# EAGLE design circuit (EAGLE 9.6.2)
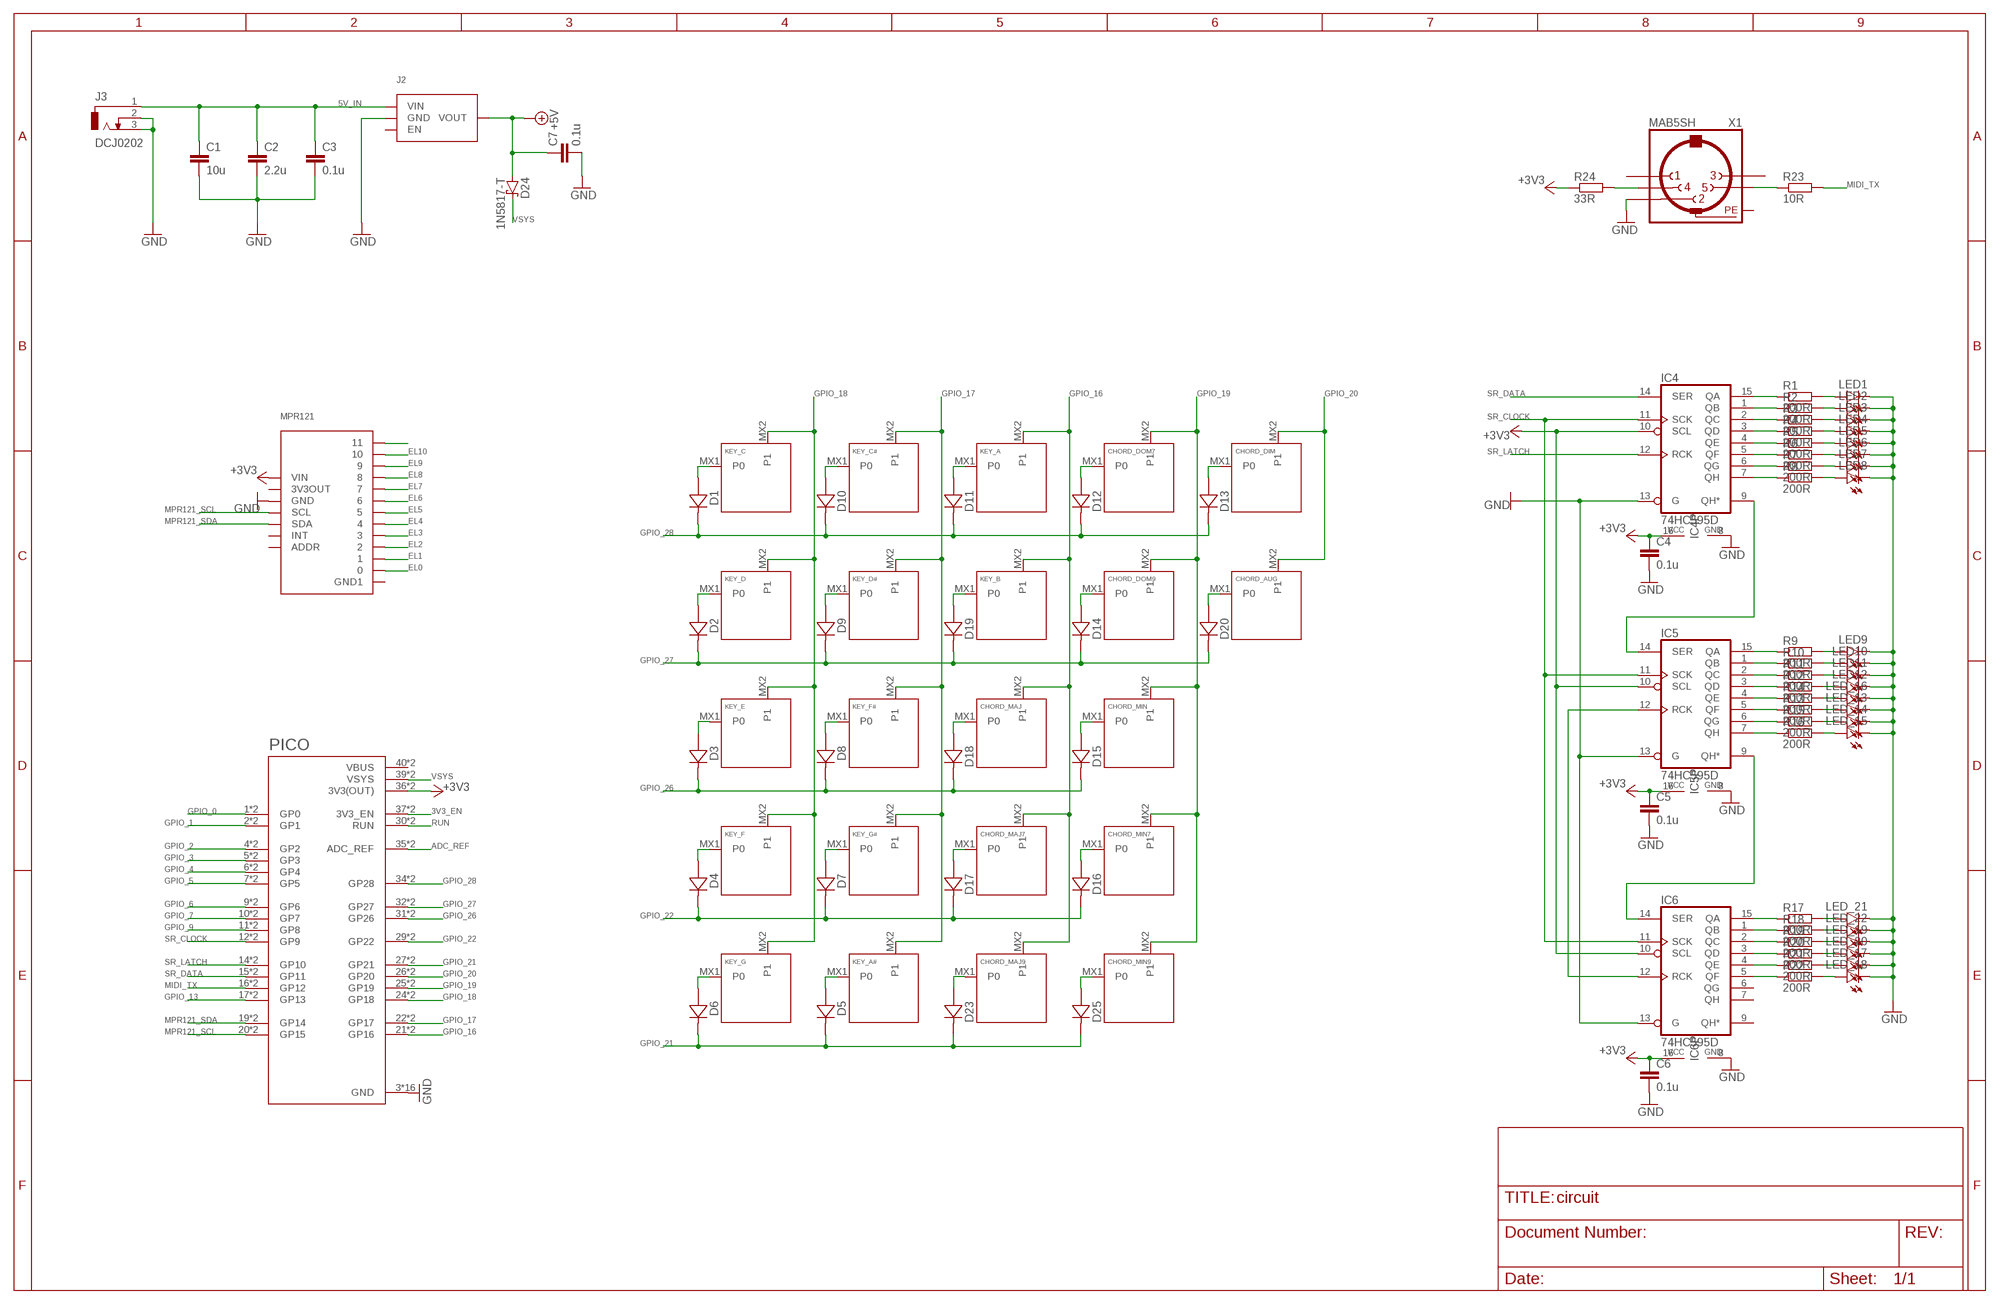
[diagram p0: schematic, sheet 1]

## Parts
C1  10u  C5/2.5  [C5B2.5]
C2  2.2u  C5/2.5  [C5B2.5]
C3  0.1u  C-EUC0805  [C0805]
C4  0.1u  C-EUC0805  [C0805]
C5  0.1u  C-EUC0805  [C0805]
C6  0.1u  C-EUC0805  [C0805]
C7  0.1u  C-EUC0805  [C0805]
CHORD_AUG  KEYSWITCH-PLAIN-MX-1U  [MX-1U]
CHORD_DIM  KEYSWITCH-PLAIN-MX-1U  [MX-1U]
CHORD_DOM7  KEYSWITCH-PLAIN-MX-1U  [MX-1U]
CHORD_DOM9  KEYSWITCH-PLAIN-MX-1U  [MX-1U]
CHORD_MAJ  KEYSWITCH-PLAIN-MX-1U  [MX-1U]
CHORD_MAJ7  KEYSWITCH-PLAIN-MX-1U  [MX-1U]
CHORD_MAJ9  KEYSWITCH-PLAIN-MX-1U  [MX-1U]
CHORD_MIN  KEYSWITCH-PLAIN-MX-1U  [MX-1U]
CHORD_MIN7  KEYSWITCH-PLAIN-MX-1U  [MX-1U]
CHORD_MIN9  KEYSWITCH-PLAIN-MX-1U  [MX-1U]
D1  DIODE-SOD-323  [SOD-323]
D2  DIODE-SOD-323  [SOD-323]
D3  DIODE-SOD-323  [SOD-323]
D4  DIODE-SOD-323  [SOD-323]
D5  DIODE-SOD-323  [SOD-323]
D6  DIODE-SOD-323  [SOD-323]
D7  DIODE-SOD-323  [SOD-323]
D8  DIODE-SOD-323  [SOD-323]
D9  DIODE-SOD-323  [SOD-323]
D10  DIODE-SOD-323  [SOD-323]
D11  DIODE-SOD-323  [SOD-323]
D12  DIODE-SOD-323  [SOD-323]
D13  DIODE-SOD-323  [SOD-323]
D14  DIODE-SOD-323  [SOD-323]
D15  DIODE-SOD-323  [SOD-323]
D16  DIODE-SOD-323  [SOD-323]
D17  DIODE-SOD-323  [SOD-323]
D18  DIODE-SOD-323  [SOD-323]
D19  DIODE-SOD-323  [SOD-323]
D20  DIODE-SOD-323  [SOD-323]
D23  DIODE-SOD-323  [SOD-323]
D24  1N5817-T  [DO41-7.6]
D25  DIODE-SOD-323  [SOD-323]
IC4  74HC595D  [SO16]
IC5  74HC595D  [SO16]
IC6  74HC595D  [SO16]
J2  DCDC_MINI_CONVERTER  [DCDC_MINI_CONVERTER]
J3  DCJ0202  [DCJ0202]
KEY_A  KEYSWITCH-PLAIN-MX-1U  [MX-1U]
KEY_A#  KEYSWITCH-PLAIN-MX-1U  [MX-1U]
KEY_B  KEYSWITCH-PLAIN-MX-1U  [MX-1U]
KEY_C  KEYSWITCH-PLAIN-MX-1U  [MX-1U]
KEY_C#  KEYSWITCH-PLAIN-MX-1U  [MX-1U]
KEY_D  KEYSWITCH-PLAIN-MX-1U  [MX-1U]
KEY_D#  KEYSWITCH-PLAIN-MX-1U  [MX-1U]
KEY_E  KEYSWITCH-PLAIN-MX-1U  [MX-1U]
KEY_F  KEYSWITCH-PLAIN-MX-1U  [MX-1U]
KEY_F#  KEYSWITCH-PLAIN-MX-1U  [MX-1U]
KEY_G  KEYSWITCH-PLAIN-MX-1U  [MX-1U]
KEY_G#  KEYSWITCH-PLAIN-MX-1U  [MX-1U]
LED1  LEDCHIPLED_0805  [CHIPLED_0805]
LED2  LEDCHIPLED_0805  [CHIPLED_0805]
LED3  LEDCHIPLED_0805  [CHIPLED_0805]
LED4  LEDCHIPLED_0805  [CHIPLED_0805]
LED5  LEDCHIPLED_0805  [CHIPLED_0805]
LED6  LEDCHIPLED_0805  [CHIPLED_0805]
LED7  LEDCHIPLED_0805  [CHIPLED_0805]
LED8  LEDCHIPLED_0805  [CHIPLED_0805]
LED9  LEDCHIPLED_0805  [CHIPLED_0805]
LED10  LEDCHIPLED_0805  [CHIPLED_0805]
LED11  LEDCHIPLED_0805  [CHIPLED_0805]
LED12  LEDCHIPLED_0805  [CHIPLED_0805]
LED_13  LEDCHIPLED_0805  [CHIPLED_0805]
LED_14  LEDCHIPLED_0805  [CHIPLED_0805]
LED_15  LEDCHIPLED_0805  [CHIPLED_0805]
LED_16  LEDCHIPLED_0805  [CHIPLED_0805]
LED_17  LEDCHIPLED_0805  [CHIPLED_0805]
LED_18  LEDCHIPLED_0805  [CHIPLED_0805]
LED_19  LEDCHIPLED_0805  [CHIPLED_0805]
LED_20  LEDCHIPLED_0805  [CHIPLED_0805]
LED_21  LEDCHIPLED_0805  [CHIPLED_0805]
LED_22  LEDCHIPLED_0805  [CHIPLED_0805]
MPR121  MPR121_ADAFRUIT  [ADAFRUIT_MPR121]
PICO  RASPBERRY_PICO-NO_DEBUG  [PICO-PKG-NO_DEBUG]
R1  200R  R-EU_R0805  [R0805]
R2  200R  R-EU_R0805  [R0805]
R3  200R  R-EU_R0805  [R0805]
R4  200R  R-EU_R0805  [R0805]
R5  200R  R-EU_R0805  [R0805]
R6  200R  R-EU_R0805  [R0805]
R7  200R  R-EU_R0805  [R0805]
R8  200R  R-EU_R0805  [R0805]
R9  200R  R-EU_R0805  [R0805]
R10  200R  R-EU_R0805  [R0805]
R11  200R  R-EU_R0805  [R0805]
R12  200R  R-EU_R0805  [R0805]
R13  200R  R-EU_R0805  [R0805]
R14  200R  R-EU_R0805  [R0805]
R15  200R  R-EU_R0805  [R0805]
R16  200R  R-EU_R0805  [R0805]
R17  200R  R-EU_R0805  [R0805]
R18  200R  R-EU_R0805  [R0805]
R19  200R  R-EU_R0805  [R0805]
R20  200R  R-EU_R0805  [R0805]
R21  200R  R-EU_R0805  [R0805]
R22  200R  R-EU_R0805  [R0805]
R23  10R  R-EU_R0805  [R0805]
R24  33R  R-EU_R0805  [R0805]
X1  MAB5SH  [MAB5SH]

## Nets
3V3_EN: PICO.37(3V3_EN) PICO.P$37(3V3_EN)
5V_IN [VIN2]: C1.1 C2.1 C3.1 J2.VIN J3.1
+3V3: C4.1 C5.1 C6.1 IC4.10(SCL) IC4.16(VCC) IC5.10(SCL) IC5.16(VCC) IC6.10(SCL) IC6.16(VCC) MPR121.VCC(VIN) PICO.36(3V3(OUT)) PICO.P$36(3V3(OUT)) R24.1
+5V [VIN2]: C7.1 D24.A J2.VOUT
ADC_REF: PICO.35(ADC_REF) PICO.P$35(ADC_REF)
EL0: MPR121.0
EL1: MPR121.1
EL2: MPR121.2
EL3: MPR121.3
EL4: MPR121.4
EL5: MPR121.5
EL6: MPR121.6
EL7: MPR121.7
EL8: MPR121.8
EL9: MPR121.9
EL10: MPR121.10
EL11: MPR121.11
GND: C1.2 C2.2 C3.2 C4.2 C5.2 C6.2 C7.2 IC4.8(GND) IC4.13(G) IC5.8(GND) IC5.13(G) IC6.8(GND) IC6.13(G) J2.GND J3.2 J3.3 LED1.C LED2.C LED3.C LED4.C LED5.C LED6.C LED7.C LED8.C LED9.C LED10.C LED11.C LED12.C LED_13.C LED_14.C LED_15.C LED_16.C LED_17.C LED_18.C LED_19.C LED_20.C LED_21.C LED_22.C MPR121.GND PICO.3(GND) PICO.8(GND) PICO.13(GND) PICO.18(GND) PICO.23(GND) PICO.28(GND) PICO.33(GND) PICO.38(GND) PICO.P$3(GND) PICO.P$8(GND) PICO.P$13(GND) PICO.P$18(GND) PICO.P$23(GND) PICO.P$28(GND) PICO.P$33(GND) PICO.P$38(GND) X1.2
GPIO_0: PICO.1(GP0) PICO.P$1(GP0)
GPIO_1: PICO.2(GP1) PICO.P$2(GP1)
GPIO_2: PICO.4(GP2) PICO.P$4(GP2)
GPIO_3: PICO.5(GP3) PICO.P$5(GP3)
GPIO_4: PICO.6(GP4) PICO.P$6(GP4)
GPIO_5: PICO.7(GP5) PICO.P$7(GP5)
GPIO_6: PICO.9(GP6) PICO.P$9(GP6)
GPIO_7: PICO.10(GP7) PICO.P$10(GP7)
GPIO_9: PICO.11(GP8) PICO.P$11(GP8)
GPIO_13: PICO.17(GP13) PICO.P$17(GP13)
GPIO_16: CHORD_MAJ7.MX2(P1) CHORD_MAJ9.MX2(P1) CHORD_MAJ.MX2(P1) KEY_A.MX2(P1) KEY_B.MX2(P1) PICO.21(GP16) PICO.P$21(GP16)
GPIO_17: KEY_A#.MX2(P1) KEY_C#.MX2(P1) KEY_D#.MX2(P1) KEY_F#.MX2(P1) KEY_G#.MX2(P1) PICO.22(GP17) PICO.P$22(GP17)
GPIO_18: KEY_C.MX2(P1) KEY_D.MX2(P1) KEY_E.MX2(P1) KEY_F.MX2(P1) KEY_G.MX2(P1) PICO.24(GP18) PICO.P$24(GP18)
GPIO_19: CHORD_DOM7.MX2(P1) CHORD_DOM9.MX2(P1) CHORD_MIN7.MX2(P1) CHORD_MIN9.MX2(P1) CHORD_MIN.MX2(P1) PICO.25(GP19) PICO.P$25(GP19)
GPIO_20: CHORD_AUG.MX2(P1) CHORD_DIM.MX2(P1) PICO.26(GP20) PICO.P$26(GP20)
GPIO_21: D5.C D6.C D23.C D25.C PICO.27(GP21) PICO.P$27(GP21)
GPIO_22: D4.C D7.C D16.C D17.C PICO.29(GP22) PICO.P$29(GP22)
GPIO_26: D3.C D8.C D15.C D18.C PICO.31(GP26) PICO.P$31(GP26)
GPIO_27: D2.C D9.C D14.C D19.C D20.C PICO.32(GP27) PICO.P$32(GP27)
GPIO_28: D1.C D10.C D11.C D12.C D13.C PICO.34(GP28) PICO.P$34(GP28)
MIDI_TX: PICO.16(GP12) PICO.P$16(GP12) R23.2
MPR121_SCL: MPR121.SCL PICO.20(GP15) PICO.P$20(GP15)
MPR121_SDA: MPR121.SDA PICO.19(GP14) PICO.P$19(GP14)
N$2: IC4.9(QH*) IC5.14(SER)
N$3: IC5.9(QH*) IC6.14(SER)
N$4: LED1.A R1.2
N$5: LED2.A R2.2
N$6: LED3.A R3.2
N$7: LED4.A R4.2
N$8: LED5.A R5.2
N$9: LED6.A R6.2
N$10: LED7.A R7.2
N$11: LED8.A R8.2
N$12: LED9.A R9.2
N$13: LED10.A R10.2
N$14: LED11.A R11.2
N$15: LED12.A R12.2
N$16: LED_16.A R14.2
N$17: LED_13.A R13.2
N$18: LED_15.A R16.2
N$19: LED_14.A R15.2
N$20: LED_21.A R17.2
N$21: LED_22.A R18.2
N$22: LED_19.A R19.2
N$23: LED_20.A R20.2
N$24: LED_17.A R21.2
N$25: LED_18.A R22.2
N$26: IC4.15(QA) R1.1
N$27: IC4.1(QB) R2.1
N$28: IC4.2(QC) R3.1
N$29: IC4.3(QD) R4.1
N$30: IC4.4(QE) R5.1
N$31: IC4.5(QF) R6.1
N$32: IC4.6(QG) R7.1
N$33: IC4.7(QH) R8.1
N$34: IC5.15(QA) R9.1
N$35: IC5.1(QB) R10.1
N$36: IC5.2(QC) R11.1
N$37: IC5.3(QD) R12.1
N$38: IC5.5(QF) R13.1
N$39: IC5.4(QE) R14.1
N$40: IC5.6(QG) R15.1
N$41: IC5.7(QH) R16.1
N$42: IC6.15(QA) R17.1
N$43: IC6.1(QB) R18.1
N$44: IC6.2(QC) R19.1
N$45: IC6.3(QD) R20.1
N$46: IC6.4(QE) R21.1
N$47: IC6.5(QF) R22.1
N$48: R23.1 X1.5
N$49: R24.2 X1.4
N$50: CHORD_MAJ9.MX1(P0) D23.A
N$51: CHORD_MIN9.MX1(P0) D25.A
N$53: D1.A KEY_C.MX1(P0)
N$54: D10.A KEY_C#.MX1(P0)
N$55: D11.A KEY_A.MX1(P0)
N$56: CHORD_DOM7.MX1(P0) D12.A
N$57: CHORD_DIM.MX1(P0) D13.A
N$58: D2.A KEY_D.MX1(P0)
N$59: D3.A KEY_E.MX1(P0)
N$60: D4.A KEY_F.MX1(P0)
N$61: D6.A KEY_G.MX1(P0)
N$62: D5.A KEY_A#.MX1(P0)
N$63: D7.A KEY_G#.MX1(P0)
N$64: D8.A KEY_F#.MX1(P0)
N$65: D9.A KEY_D#.MX1(P0)
N$66: D19.A KEY_B.MX1(P0)
N$67: CHORD_MAJ.MX1(P0) D18.A
N$68: CHORD_MAJ7.MX1(P0) D17.A
N$69: CHORD_MIN7.MX1(P0) D16.A
N$72: CHORD_MIN.MX1(P0) D15.A
N$73: CHORD_DOM9.MX1(P0) D14.A
N$74: CHORD_AUG.MX1(P0) D20.A
RUN: PICO.30(RUN) PICO.P$30(RUN)
SR_CLOCK: IC4.11(SCK) IC5.11(SCK) IC6.11(SCK) PICO.12(GP9) PICO.P$12(GP9)
SR_DATA: IC4.14(SER) PICO.15(GP11) PICO.P$15(GP11)
SR_LATCH: IC4.12(RCK) IC5.12(RCK) IC6.12(RCK) PICO.14(GP10) PICO.P$14(GP10)
VSYS: D24.C PICO.39(VSYS) PICO.P$39(VSYS)
Unconnected: IC6.6(QG) IC6.7(QH) IC6.9(QH*) J2.EN MPR121.3V3OUT MPR121.ADDR MPR121.GND1 MPR121.INT X1.1 X1.3

## Power pins joined to a net without a drawn wire
PE: X1.PE X1.PE@(PE)
VBUS: PICO.40(VBUS) PICO.P$40(VBUS)

## Library data of the parts
C1 C2 = capacitor-wima:C: CAPACITOR naming: grid - package width
C3-C7 = rcl:C-EU: CAPACITOR, European symbol; SPICEPREFIX: C
CHORD_AUG CHORD_DIM CHORD_DOM7 CHORD_DOM9 CHORD_MAJ CHORD_MAJ7 CHORD_MAJ9 CHORD_MIN CHORD_MIN7 CHORD_MIN9 KEY_A KEY_A# KEY_B KEY_C KEY_C# KEY_D KEY_D# KEY_E KEY_F KEY_F# KEY_G KEY_G# = Keyboard:KEYSWITCH-PLAIN
D1-D20 D23 D25 = Components:DIODE: Standard 1N4148 diode
D24 = diode:1N581*: 1.0A SCHOTTKY BARRIER RECTIFIER Source: http://www.diodes.com/datasheets/ds23001.pdf
IC4-IC6 = 74xx-eu:74*595: 8-bit SHIFT REGISTER, output latch
J2 = Joel Custom library:DCDC_MINI_CONVERTER: Mini DC-DC buck converter
J3 = con-jack:DCJ0202: DC POWER JACK Source: DCJ0202.pdf; OC_FARNELL: unknown; OC_NEWARK: unknown
LED1-LED12 LED_13-LED_22 = led:LED: LED OSRAM: - CHIPLED LG R971, LG N971, LY N971, LG Q971, LY Q971, LO R971, LY R971 LH N974, LH R974 LS Q976, LO Q976, LY Q976 LO Q996 - Hyper CHIPLED LW Q18S LB Q993, LB Q99A, LB R99A - SideLED LS A670, LO A670, LY A670, LG A670, LP A670 LB A673, LV A673, LT A673, LW A673 LH A674 LY A675 LS A676, LA A676, LO A676, LY A676, LW A676 LS A679, LY A679, LG A679 - Hyper Micro SIDELED® LS Y876, LA Y876, LO Y876, LY Y876 LT Y87S - SmartLED LW L88C, LW L88S LB L89C, LB L89S, LG L890 LS L89K, LO L89K, LY L89K LS L896, LA L896, LO L896, LY L896 - TOPLED LS T670, LO T670, LY T670, LG T670, LP T670 LSG T670, LSP T670, LSY T670, LOP T670, LYG T670 LG T671, LOG T671, LSG T671 LB T673, LV T673, LT T673, LW T673 LH T674 LS T676, LA T676, LO T676, LY T676, LB T676, LH T676, LSB T676, LW T676 LB T67C, LV T67C, LT T67C, LS T67K, LO T67K, LY T67K, LW E67C LS E67B, LA E67B, LO E67B, LY E67B, LB E67C, LV E67C, LT E67C LW T67C LS T679, LY T679, LG T679 LS T770, LO T770, LY T770, LG T770, LP T770 LB T773, LV T773, LT T773, LW T773 LH T774 LS E675, LA E675, LY E675, LS T675 LS T776, LA T776, LO T776, LY T776, LB T776 LHGB T686 LT T68C, LB T68C - Hyper Mini TOPLED® LB M676 - Mini TOPLED Santana® LG M470 LS M47K, LO M47K, LY M47K Source: http://www.osram.convergy.de LUXEON: - LUMILED® LXK2-PW12-R00, LXK2-PW12-S00, LXK2-PW14-U00, LXK2-PW14-V00 LXK2-PM12-R00, LXK2-PM12-S00, LXK2-PM14-U00 LXK2-PE12-Q00, LXK2-PE12-R00, LXK2-PE12-S00, LXK2-PE14-T00, LXK2-PE14-U00 LXK2-PB12-K00, LXK2-PB12-L00, LXK2-PB12-M00, LXK2-PB14-N00, LXK2-PB14-P00, LXK2-PB14-Q00 LXK2-PR12-L00, LXK2-PR12-M00, LXK2-PR14-Q00, LXK2-PR14-R00 LXK2-PD12-Q00, LXK2-PD12-R00, LXK2-PD12-S00 LXK2-PH12-R00, LXK2-PH12-S00 LXK2-PL12-P00, LXK2-PL12-Q00, LXK2-PL12-R00 Source: www.luxeon.com KINGBRIGHT: KA-3528ASYC Source: www.kingbright.com
MPR121 = Joel Custom library:MPR121_ADAFRUIT
PICO = RpiPico:RASPBERRY_PICO-NO_DEBUG
R1-R24 = rcl:R-EU_: RESISTOR, European symbol; SPICEPREFIX: R
X1 = con-hirschmann:MAB5SH: Female CONNECTOR 5 pins 90 deg. with shield, horizontal (DIN 41524); OC_FARNELL: 809883; OC_NEWARK: unknown

## Net classes
1 VIN2: clearance 0.559 mm

## Board
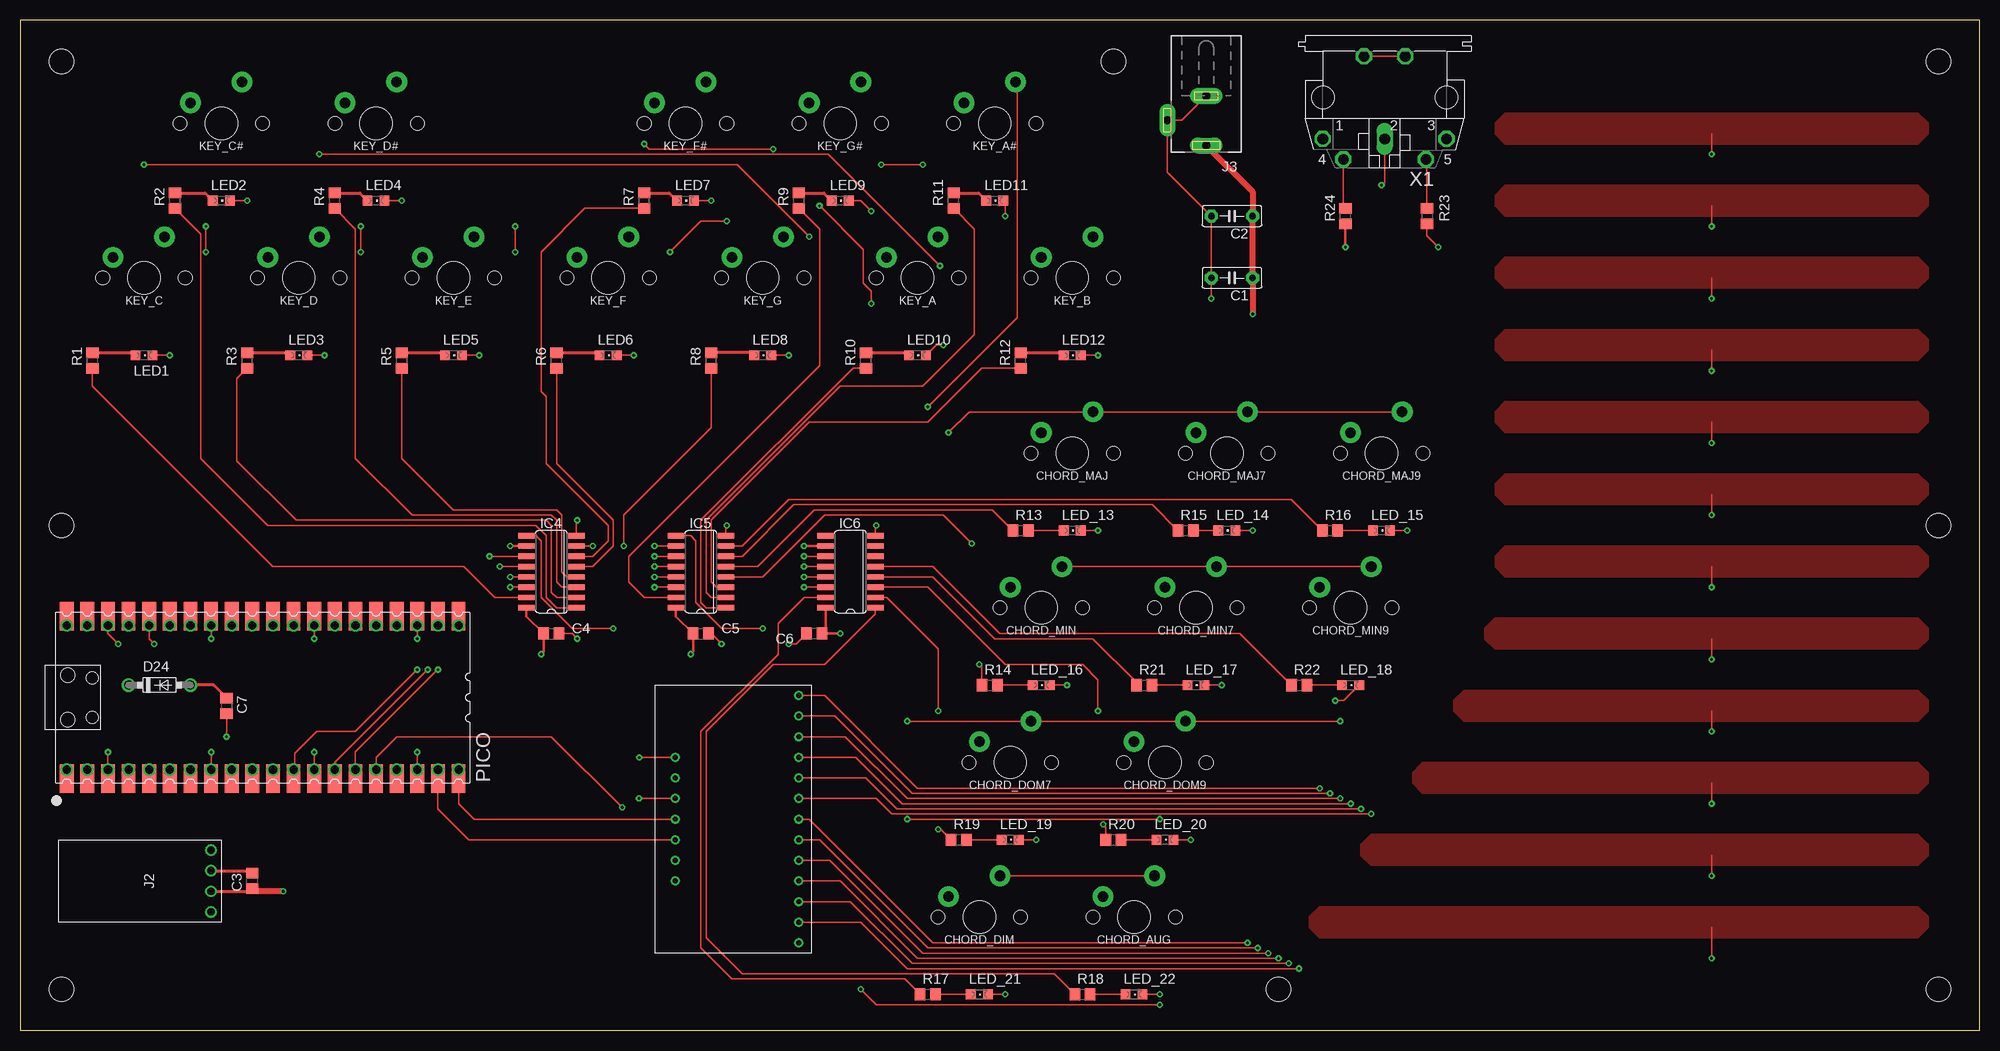
[diagram p1: board, top side]
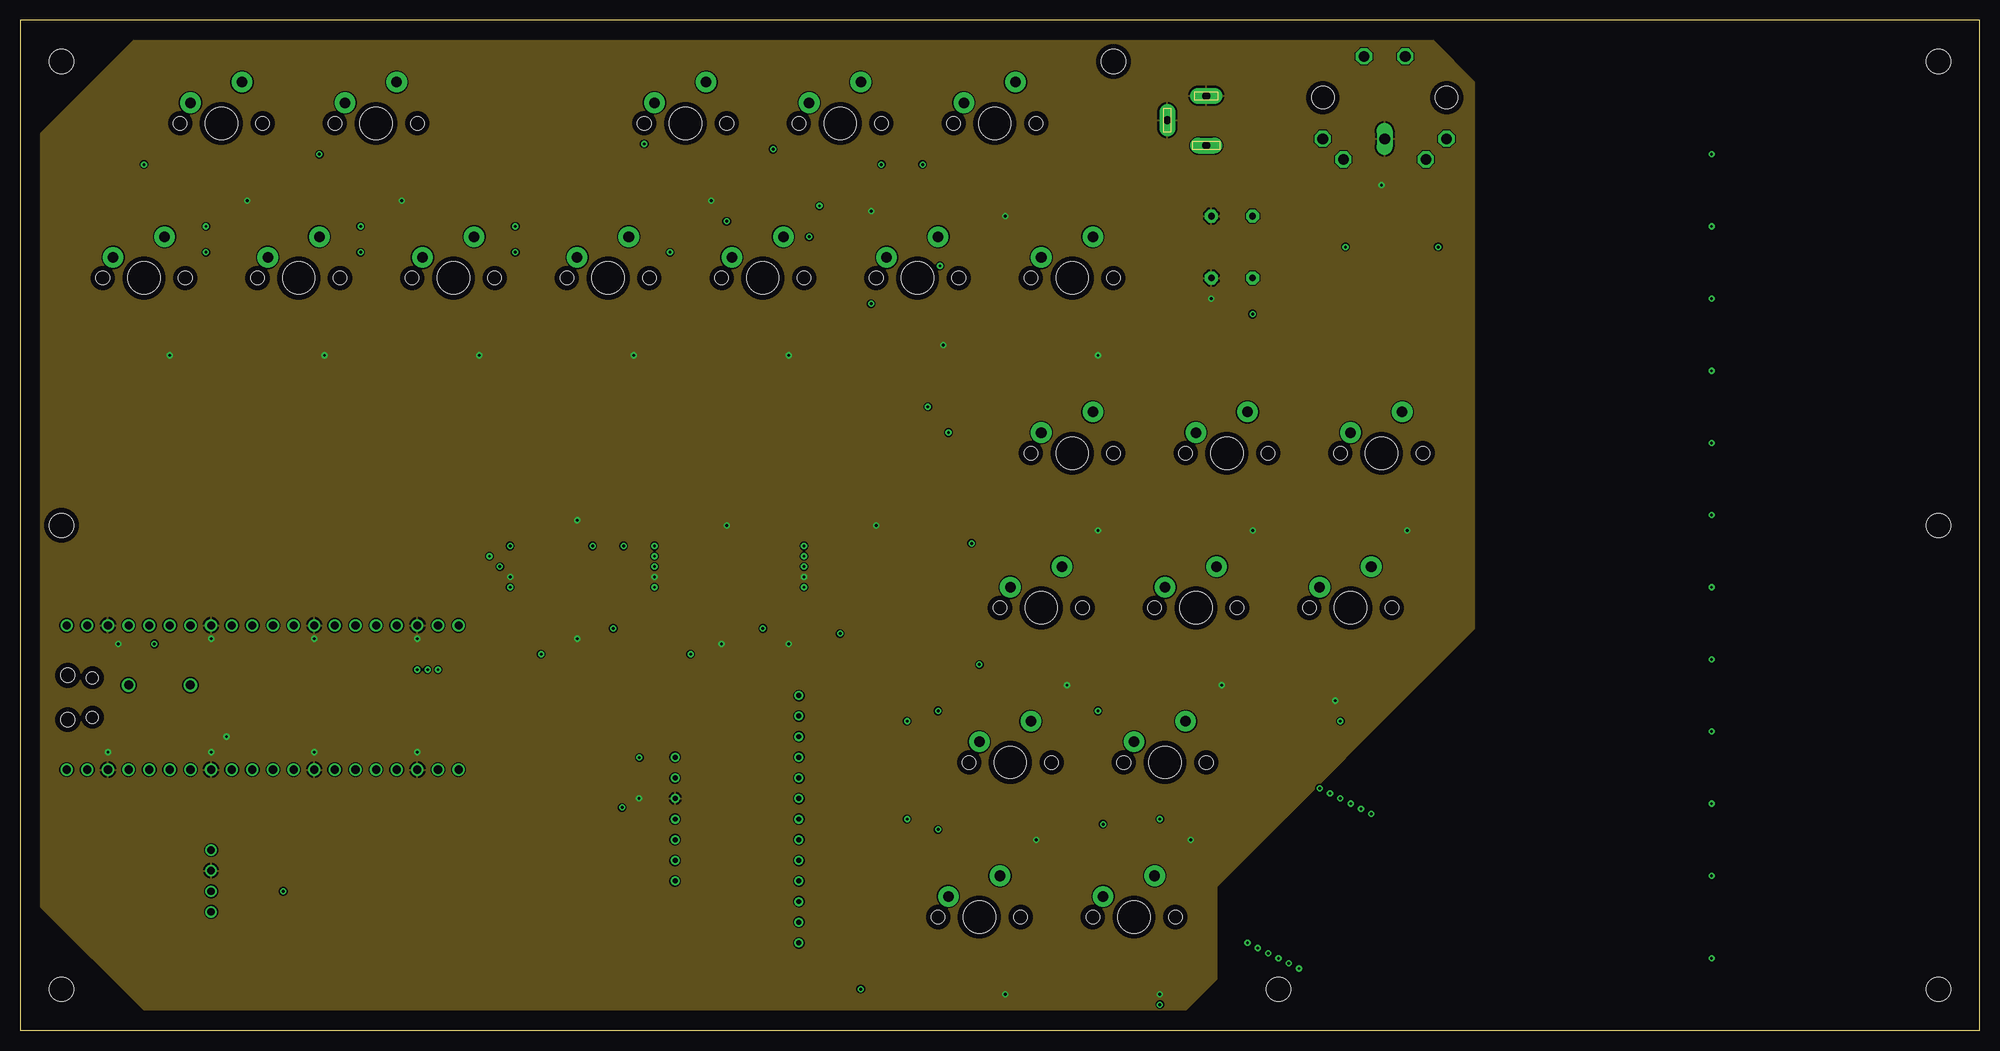
[diagram p2: board, inner layer Route2]
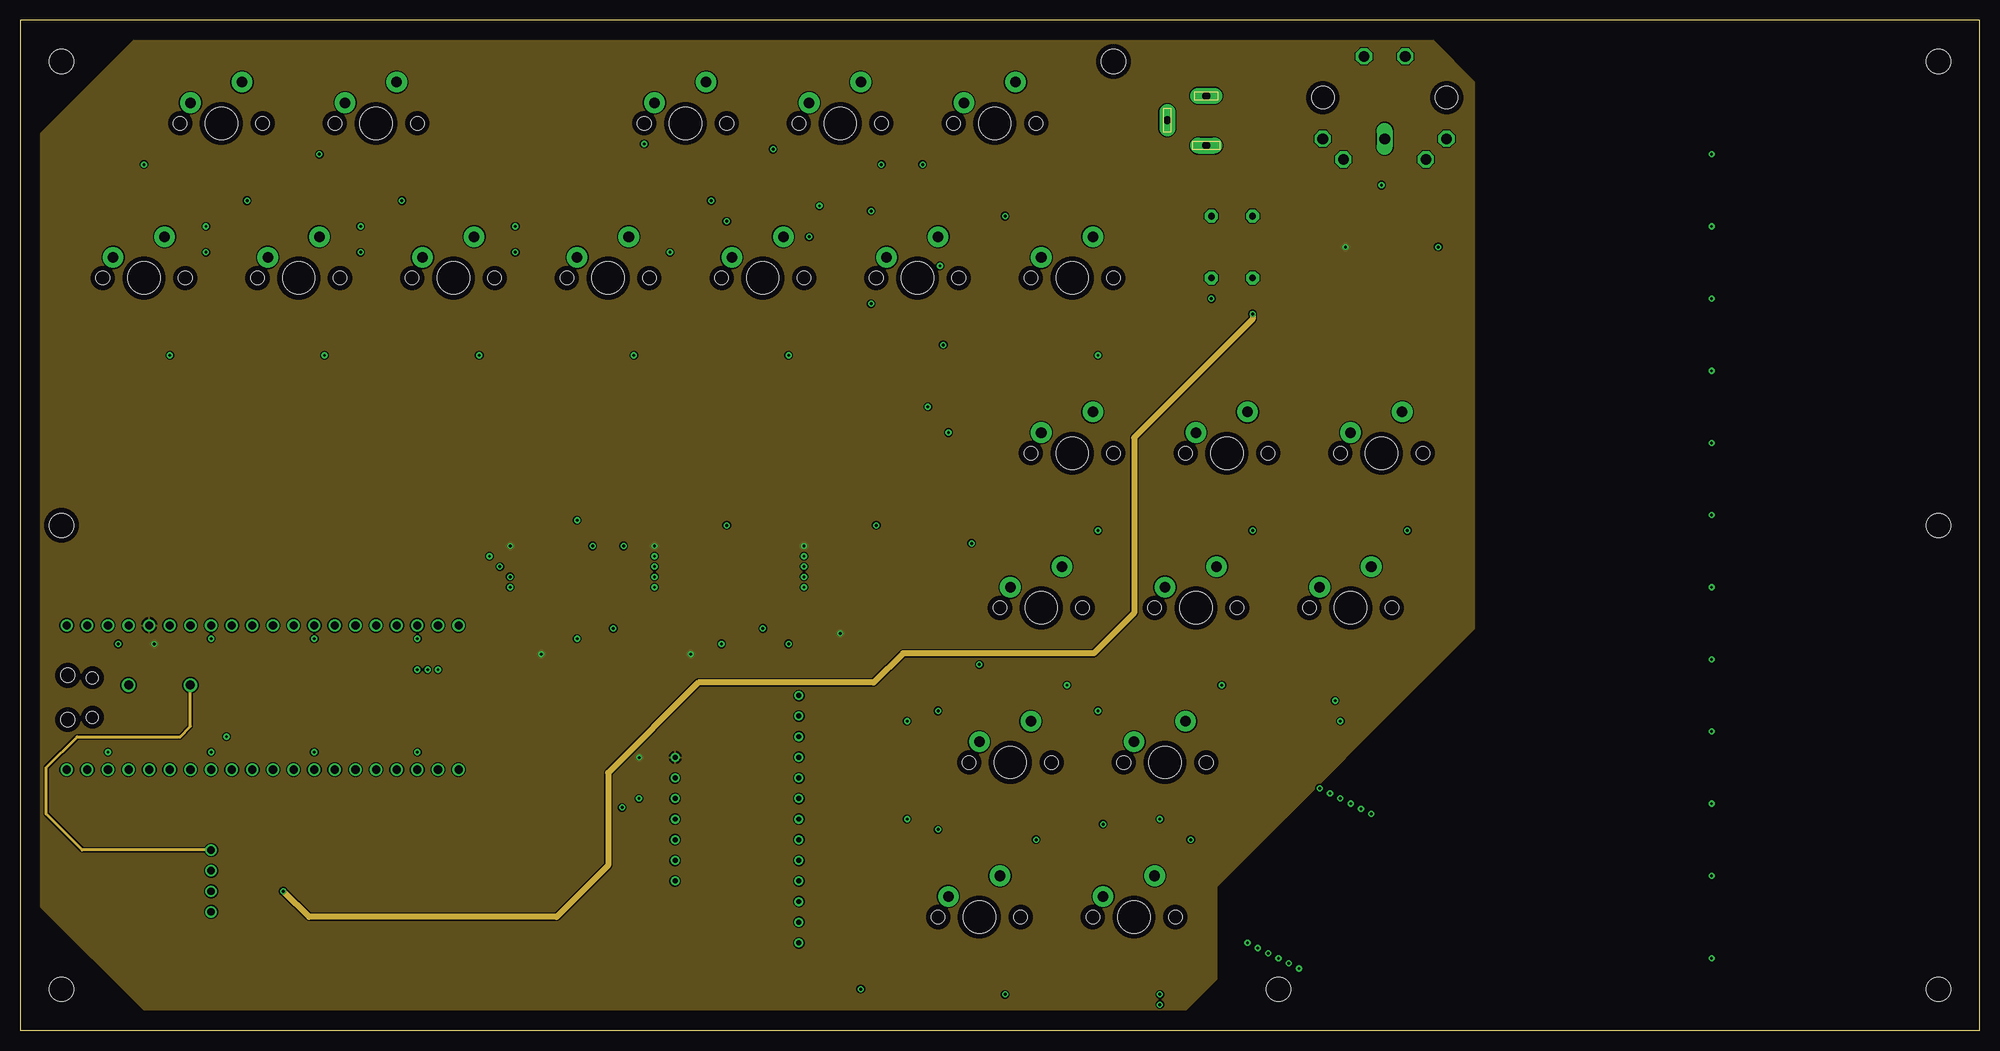
[diagram p3: board, inner layer Route15]
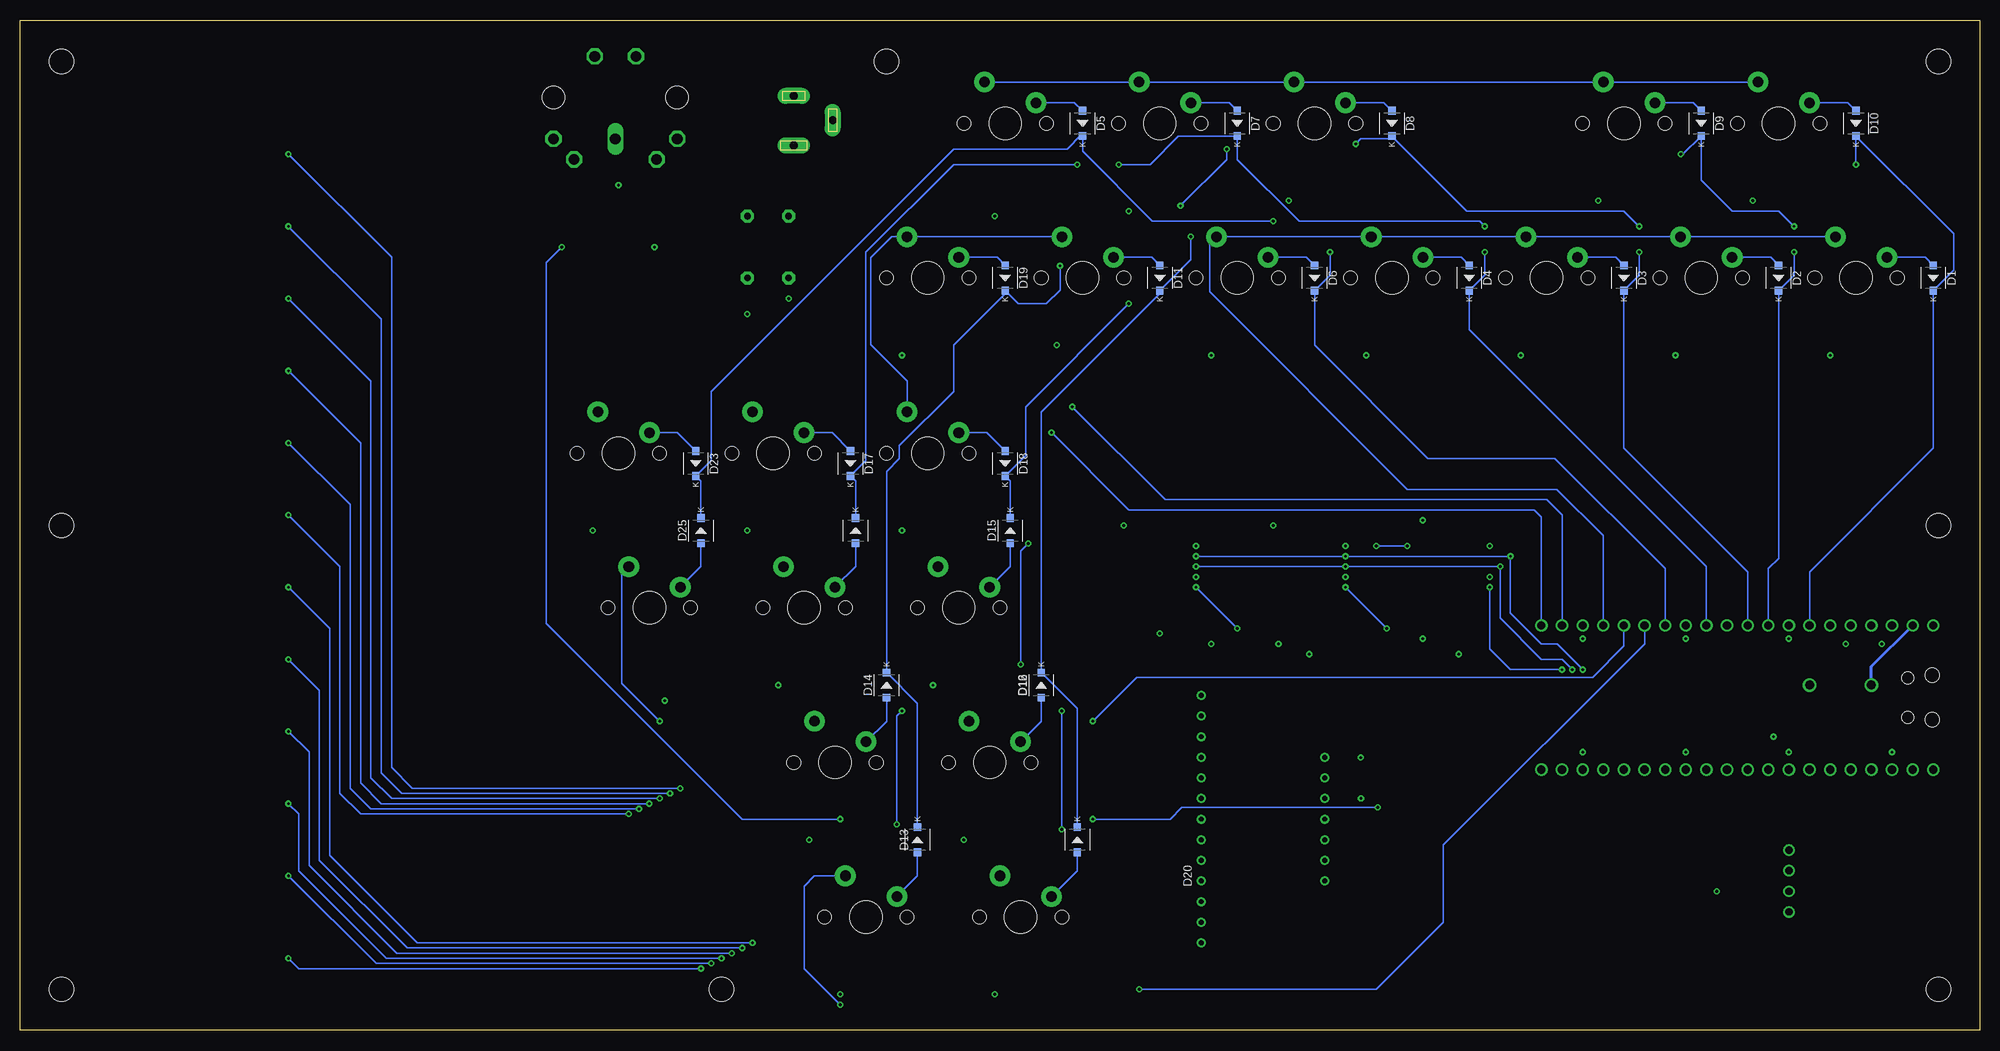
[diagram p4: board, bottom side, seen from below]

Size 241.3 x 124.46 mm. Coordinates in mm from the lower left corner, seen from the top.
Outline: 0,0 241.3,0 241.3,124.46 0,124.46 0,0
Copper layers (1+2*15+16): Top 0.035mm / dielectric 1.5mm / Route2 0.035mm / dielectric 0.15mm / Route15 0.035mm / dielectric 0.2mm / Bottom 0.035mm
Design rules "JLCPCB 4layer *": minimum track width 6mil, minimum drill 0.35mm, track to track 6mil, track to pad 6mil, pad to pad 6mil, via to via 6mil, smd to smd 6mil, copper to edge 25mil, drill to drill 10mil, minimum pad ring 10mil, minimum via ring 8mil, stop-mask expansion 4mil, vias tented up to drill 0mil, thermal gap 10mil
Holes 3 mm at 5.08,5.08 236.22,5.08 236.22,119.38 5.08,119.38 236.22,62.23 5.08,62.23 154.94,5.08 134.62,119.38

### Footprints (pad centres in the part's own frame; a part is rotated, then mirrored left to right if it is on the bottom)
C5B2.5 = drill 0.813 pad 1.6 octagon: 1 -2.54,0; 2 2.54,0
C0805 = smd 1.3 x 1.5: 1 -0.95,0; 2 0.95,0
MX-1U = drill 1.3 pad 2.54: MX1 -3.81,2.54; MX2 2.54,5.08 | hole 4: 0,0 | hole 1.7: -5.08,0; 5.08,0
SOD-323 = smd 0.95 x 0.9: A -1.55,0; C 1.55,0
DO41-7.6 = drill 1.1 pad 1.7: A 3.81,0; C -3.81,0
SO16 = smd 0.66 x 2.032: 1 -4.445,-3.073; 2 -3.175,-3.073; 3 -1.905,-3.073; 4 -0.635,-3.073; 5 0.635,-3.073; 6 1.905,-3.073; 7 3.175,-3.073; 8 4.445,-3.073; 9 4.445,3.073; 10 3.175,3.073; 11 1.905,3.073; 12 0.635,3.073; 13 -0.635,3.073; 14 -1.905,3.073; 15 -3.175,3.073; 16 -4.445,3.073
DCDC_MINI_CONVERTER = drill 0.9: EN 3.81,0; GND -1.27,0; VIN 1.27,0; VOUT -3.81,0
DCJ0202 = drill 1 pad 2 long: 1 0,3.1; 2 4.8,0; 3 0,-3
CHIPLED_0805 = smd 1.2 x 1.2: A 0,-1.05; C 0,1.05
ADAFRUIT_MPR121 = drill 0.6: 0 29.21,17.78; 1 26.67,17.78; 2 24.13,17.78; 3 21.59,17.78; 3V3OUT 11.43,2.54; 4 19.05,17.78; 5 16.51,17.78; 6 13.97,17.78; 7 11.43,17.78; 8 8.89,17.78; 9 6.35,17.78; 10 3.81,17.78; 11 1.27,17.78; ADDR 24.13,2.54; GND 13.97,2.54; GND1 31.75,17.78; INT 21.59,2.54; SCL 16.51,2.54; SDA 19.05,2.54; VCC 8.89,2.54
PICO-PKG-NO_DEBUG = drill 1: 1 -7.62,25.4; 2 -7.62,22.86; 3 -7.62,20.32; 4 -7.62,17.78; 5 -7.62,15.24; 6 -7.62,12.7; 7 -7.62,10.16; 8 -7.62,7.62; 9 -7.62,5.08; 10 -7.62,2.54; 11 -7.62,0; 12 -7.62,-2.54; 13 -7.62,-5.08; 14 -7.62,-7.62; 15 -7.62,-10.16; 16 -7.62,-12.7; 17 -7.62,-15.24; 18 -7.62,-17.78; 19 -7.62,-20.32; 20 -7.62,-22.86; 21 10.16,-22.86; 22 10.16,-20.32; 23 10.16,-17.78; 24 10.16,-15.24; 25 10.16,-12.7; 26 10.16,-10.16; 27 10.16,-7.62; 28 10.16,-5.08; 29 10.16,-2.54; 30 10.16,0; 31 10.16,2.54; 32 10.16,5.08; 33 10.16,7.62; 34 10.16,10.16; 35 10.16,12.7; 36 10.16,15.24; 37 10.16,17.78; 38 10.16,20.32; 39 10.16,22.86; 40 10.16,25.4 | smd 3.5 x 1.7: P$1 -8.73,25.4; P$2 -8.73,22.86; P$3 -8.73,20.32; P$4 -8.73,17.78; P$5 -8.73,15.24; P$6 -8.73,12.7; P$7 -8.73,10.16; P$8 -8.73,7.62; P$9 -8.73,5.08; P$10 -8.73,2.54; P$11 -8.73,0; P$12 -8.73,-2.54; P$13 -8.73,-5.08; P$14 -8.73,-7.62; P$15 -8.73,-10.16; P$16 -8.73,-12.7; P$17 -8.73,-15.24; P$18 -8.73,-17.78; P$19 -8.73,-20.32; P$20 -8.73,-22.86; P$21 11.27,-22.86; P$22 11.27,-20.32; P$23 11.27,-17.78; P$24 11.27,-15.24; P$25 11.27,-12.7; P$26 11.27,-10.16; P$27 11.27,-7.62; P$28 11.27,-5.08; P$29 11.27,-2.54; P$30 11.27,0; P$31 11.27,2.54; P$32 11.27,5.08; P$33 11.27,7.62; P$34 11.27,10.16; P$35 11.27,12.7; P$36 11.27,15.24; P$37 11.27,17.78; P$38 11.27,20.32; P$39 11.27,22.86; P$40 11.27,25.4 | hole 1.8: -1.455,25.27; 3.995,25.27 | hole 1.5: -1.155,22.24; 3.695,22.24
R0805 = smd 1.3 x 1.5: 1 -0.95,0; 2 0.95,0
MAB5SH = drill 1.321 octagon: 1 7.62,5.08; 3 -7.62,5.08; 4 5.08,7.62; 5 -5.08,7.62; PE -2.54,-5.08; PE@ 2.54,-5.08 | drill 1.321 long: 2 0,5.08 | hole 2.794: 7.62,0; -7.62,0

### Placement (x,y rotation side)
C1  149.22,92.71 180 top
C2  149.22,100.33 180 top
C3  28.57,18.41 90 top
C4  65.41,48.9 0 top
C5  83.82,48.9 0 top
C6  97.79,48.9 180 top
C7  25.4,40.01 270 top
CHORD_AUG  137.16,13.97 0 top
CHORD_DIM  118.11,13.97 0 top
CHORD_DOM7  121.92,33.02 0 top
CHORD_DOM9  140.97,33.02 0 top
CHORD_MAJ  129.54,71.12 0 top
CHORD_MAJ7  148.59,71.12 0 top
CHORD_MAJ9  167.64,71.12 0 top
CHORD_MIN  125.73,52.07 0 top
CHORD_MIN7  144.78,52.07 0 top
CHORD_MIN9  163.83,52.07 0 top
D1  5.71,92.71 270 bottom
D2  24.77,92.71 270 bottom
D3  43.81,92.71 270 bottom
D4  62.87,92.71 270 bottom
D5  110.49,111.76 270 bottom
D6  81.92,92.71 270 bottom
D7  91.44,111.76 270 bottom
D8  72.39,111.76 270 bottom
D9  34.29,111.76 270 bottom
D10  15.24,111.76 270 bottom
D11  100.97,92.71 270 bottom
D12  115.57,42.55 90 bottom
D13  111.12,23.5 90 bottom
D14  134.62,42.55 90 bottom
D15  119.38,61.59 90 bottom
D16  138.43,61.59 90 bottom
D17  139.06,69.85 270 bottom
D18  120.02,69.85 270 bottom
D19  120.02,92.71 270 bottom
D20  130.81,23.5 90 bottom
D23  158.12,69.85 270 bottom
D24  17.14,42.55 0 top
D25  157.48,61.59 90 bottom
IC4  65.41,56.52 90 top
IC5  83.82,56.52 90 top
IC6  102.23,56.52 90 top
J2  23.5,18.41 270 top
J3  146.05,112.14 180 top
KEY_A  110.49,92.71 0 top
KEY_A#  120.02,111.76 0 top
KEY_B  129.54,92.71 0 top
KEY_C  15.24,92.71 0 top
KEY_C#  24.77,111.76 0 top
KEY_D  34.29,92.71 0 top
KEY_D#  43.81,111.76 0 top
KEY_E  53.34,92.71 0 top
KEY_F  72.39,92.71 0 top
KEY_F#  81.92,111.76 0 top
KEY_G  91.44,92.71 0 top
KEY_G#  100.97,111.76 0 top
LED1  15.24,83.19 270 top
LED2  24.77,102.23 270 top
LED3  34.29,83.19 270 top
LED4  43.81,102.23 270 top
LED5  53.34,83.19 270 top
LED6  72.39,83.19 270 top
LED7  81.92,102.23 270 top
LED8  91.44,83.19 270 top
LED9  100.97,102.23 270 top
LED10  110.49,83.19 270 top
LED11  120.02,102.23 270 top
LED12  129.54,83.19 270 top
LED_13  129.54,61.59 270 top
LED_14  148.59,61.59 270 top
LED_15  167.64,61.59 270 top
LED_16  125.73,42.55 270 top
LED_17  144.78,42.55 270 top
LED_18  163.83,42.55 270 top
LED_19  121.92,23.5 270 top
LED_20  140.97,23.5 270 top
LED_21  118.11,4.45 270 top
LED_22  137.16,4.45 270 top
MPR121  78.11,42.55 270 top
PICO  31.11,39.75 90 top
R1  8.89,82.55 90 top
R2  19.05,102.23 90 top
R3  27.94,82.55 90 top
R4  38.73,102.23 90 top
R5  46.99,82.55 90 top
R6  66.04,82.55 90 top
R7  76.83,102.23 90 top
R8  85.09,82.55 90 top
R9  95.89,102.23 90 top
R10  104.14,82.55 90 top
R11  114.94,102.23 90 top
R12  123.19,82.55 90 top
R13  123.19,61.59 0 top
R14  119.38,42.55 0 top
R15  143.51,61.59 0 top
R16  161.29,61.59 0 top
R17  111.76,4.45 0 top
R18  130.81,4.45 0 top
R19  115.57,23.5 0 top
R20  134.62,23.5 0 top
R21  138.43,42.55 0 top
R22  157.48,42.55 0 top
R23  173.23,100.33 270 top
R24  163.19,100.33 90 top
X1  168.02,114.94 180 top

### Tracks (layer width: path | path; a pad name or v marks a point on that pad's centre or on a via)
3V3_EN
  Top 0.203: PICO.P$37 PICO.37
5V_IN  (via drill 0.35)
  Top 0.381: J2.VIN 28.25,17.14 28.41,17.3 C3.1
  Top 0.762: J3.1 151.76,103.33 C2.1 C1.1 v151.76,88.27 | v32.38,17.14 28.57,17.14 28.41,17.3
  Route15 0.762: v151.76,88.27 151.76,87.63 137.16,73.03 137.16,51.44 132.2,46.48 108.71,46.48 105.09,42.86 83.5,42.86 72.39,31.75 72.39,20.32 66.04,13.97 35.56,13.97 v32.38,17.14
+3V3  (via drill 0.35)
  Top 0.203: 100.33,59.69 IC6.10 | IC5.10 v78.11,59.69 | MPR121.VCC 76.27,33.66 v76.23,33.62 | PICO.P$36 15.88,48.26 v16.51,47.62
  Top 0.305: IC4.16 62.33,51.02 C4.1 64.45,46.67 v64.14,46.35 | IC5.16 80.75,51.02 C5.1 82.87,46.67 v82.55,46.35 | IC6.16 99.16,49.32 C6.1 v100.97,48.9 | IC4.10 v60.33,59.69 | IC6.10 v96.52,59.69 | R24.1 v163.19,96.52
  pour Route15: 2.54,110.49 13.97,121.92 173.99,121.92 179.07,116.84 179.07,49.53 147.32,17.78 147.32,6.35 143.51,2.54 15.24,2.54 2.54,15.24
+5V
  Top 0.381: C7.1 23.81,42.55 D24.A
  Route15 0.381: J2.VOUT 7.62,22.23 3.17,26.67 3.17,32.38 6.99,36.2 19.68,36.2 20.95,37.47 D24.A
ADC_REF
  Top 0.203: PICO.P$35 PICO.35
EL0  (via drill 0.35)
  Top 0.203: MPR121.0 103.5,13.34 109.22,7.62 v157.48,7.62 | v208.28,8.89 208.28,12.7
  Bottom 0.203: v157.48,7.62 207.01,7.62 v208.28,8.89
  pour Top: 234.95,12.7 234.95,13.97 233.68,15.24 160.02,15.24 158.75,13.97 158.75,12.7 160.02,11.43 233.68,11.43
EL1  (via drill 0.35)
  Top 0.203: MPR121.1 102.23,15.88 109.86,8.26 v156.21,8.26 | v208.28,19.05 208.28,21.59
  Bottom 0.203: v156.21,8.26 197.49,8.26 v208.28,19.05
  pour Top: 165.1,21.59 166.37,20.32 233.68,20.32 234.95,21.59 234.95,22.86 233.68,24.13 166.37,24.13 165.1,22.86
EL2  (via drill 0.35)
  Top 0.203: MPR121.2 100.97,18.41 110.49,8.89 v154.94,8.89 | v208.28,27.94 208.28,30.48
  Bottom 0.203: v154.94,8.89 196.22,8.89 207.01,19.68 207.01,26.67 v208.28,27.94
  pour Top: 172.72,29.21 171.45,30.48 171.45,31.75 172.72,33.02 233.68,33.02 234.95,31.75 234.95,30.48 233.68,29.21
EL3  (via drill 0.35)
  Top 0.203: MPR121.3 99.69,20.95 111.12,9.53 v153.67,9.53 | v208.28,36.83 208.28,39.37
  Bottom 0.203: v153.67,9.53 194.94,9.53 205.74,20.32 205.74,34.29 v208.28,36.83
  pour Top: 177.8,38.1 176.53,39.37 176.53,40.64 177.8,41.91 233.68,41.91 234.95,40.64 234.95,39.37 233.68,38.1
EL4  (via drill 0.35)
  Top 0.203: MPR121.4 98.42,23.5 111.76,10.16 v152.4,10.16 | v208.28,45.72 208.28,48.26
  Bottom 0.203: v152.4,10.16 193.68,10.16 204.47,20.95 204.47,41.91 v208.28,45.72
  pour Top: 180.34,48.26 181.61,46.99 233.68,46.99 234.95,48.26 234.95,49.53 233.68,50.8 181.61,50.8 180.34,49.53
EL5  (via drill 0.35)
  Top 0.203: MPR121.5 97.16,26.04 112.39,10.79 v151.13,10.79 | v208.28,54.61 208.28,57.15
  Bottom 0.203: v151.13,10.79 192.41,10.79 203.2,21.59 203.2,49.53 v208.28,54.61
  pour Top: 182.88,55.88 181.61,57.15 181.61,58.42 182.88,59.69 233.68,59.69 234.95,58.42 234.95,57.15 233.68,55.88
EL6  (via drill 0.35)
  Top 0.203: MPR121.6 105.41,28.57 107.31,26.67 v166.37,26.67 | v208.28,63.5 208.28,66.04
  Bottom 0.203: v166.37,26.67 199.39,26.67 201.93,29.21 201.93,57.15 v208.28,63.5
  pour Top: 181.61,67.31 181.61,66.04 182.88,64.77 233.68,64.77 234.95,66.04 234.95,67.31 233.68,68.58 182.88,68.58
EL7  (via drill 0.35)
  Top 0.203: MPR121.7 104.14,31.11 107.95,27.3 v165.1,27.3 | v208.28,72.39 208.28,74.93
  Bottom 0.203: v165.1,27.3 198.12,27.3 200.66,29.84 200.66,64.77 v208.28,72.39
  pour Top: 181.61,76.2 181.61,74.93 182.88,73.66 233.68,73.66 234.95,74.93 234.95,76.2 233.68,77.47 182.88,77.47
EL8  (via drill 0.35)
  Top 0.203: MPR121.8 102.87,33.66 108.58,27.94 v163.83,27.94 | v208.28,81.28 208.28,83.82
  Bottom 0.203: v163.83,27.94 196.85,27.94 199.39,30.48 199.39,72.39 v208.28,81.28
  pour Top: 181.61,85.09 181.61,83.82 182.88,82.55 233.68,82.55 234.95,83.82 234.95,85.09 233.68,86.36 182.88,86.36
EL9  (via drill 0.35)
  Top 0.203: MPR121.9 101.6,36.2 109.22,28.57 v162.56,28.57 | v208.28,90.17 208.28,92.71
  Bottom 0.203: v162.56,28.57 195.58,28.57 198.12,31.11 198.12,80.01 v208.28,90.17
  pour Top: 181.61,93.98 181.61,92.71 182.88,91.44 233.68,91.44 234.95,92.71 234.95,93.98 233.68,95.25 182.88,95.25
EL10  (via drill 0.35)
  Top 0.203: MPR121.10 100.33,38.73 109.86,29.21 v161.29,29.21 | v208.28,99.06 208.28,101.6
  Bottom 0.203: v161.29,29.21 194.31,29.21 196.85,31.75 196.85,87.63 v208.28,99.06
  pour Top: 181.61,102.87 181.61,101.6 182.88,100.33 233.68,100.33 234.95,101.6 234.95,102.87 233.68,104.14 182.88,104.14
EL11  (via drill 0.35)
  Top 0.203: MPR121.11 99.06,41.27 110.49,29.84 v160.02,29.84 | v208.28,107.95 208.28,110.49
  Bottom 0.203: v160.02,29.84 193.04,29.84 195.58,32.38 195.58,95.25 v208.28,107.95
  pour Top: 182.88,109.22 181.61,110.49 181.61,111.76 182.88,113.03 233.68,113.03 234.95,111.76 234.95,110.49 233.68,109.22
GND  (via drill 0.35)
  Top 0.203: LED2.C v27.94,102.23 | LED4.C v46.99,102.23 | LED1.C v18.41,83.19 | LED3.C v37.47,83.19 | LED5.C v56.52,83.19 | LED6.C v75.56,83.19 | LED7.C v85.09,102.23 | LED9.C 103.5,102.23 v104.78,100.97 | LED11.C 121.28,102.02 v121.28,100.33 | LED12.C v132.72,83.19 | LED10.C 112.81,84.45 v113.67,84.45 | LED8.C v94.61,83.19 | C7.2 v25.4,36.2 | LED_21.C v121.28,4.45 | LED_22.C v140.34,4.45 | LED_19.C v125.09,23.5 | LED_20.C v144.15,23.5 | LED_16.C v128.91,42.55 | LED_17.C v147.96,42.55 | LED_18.C 162.97,40.64 v161.93,40.64 | LED_15.C v170.81,61.59 | LED_14.C v151.76,61.59 | LED_13.C v132.72,61.59 | J3.3 143.05,112.14 J3.2 141.25,105.77 C2.2 C1.2 v146.69,90.17 | X1.2 168.02,104.52 v167.64,104.14 | MPR121.GND v76.2,28.57 | C5.2 85.09,48.9 v86.36,47.62 | C6.2 95.57,47.62 v94.61,47.62 | C4.2 67.94,48.9 v68.58,48.26 | IC4.13 v60.33,55.88 | IC5.13 v78.11,55.88 | IC6.13 v96.52,55.88 | IC5.8 86.89,62.13 v87,62.23 | IC6.8 105.31,62.13 v105.41,62.23 | IC4.8 68.48,62.76 v68.58,62.87 | PICO.P$33 v23.5,48.26 | PICO.P$28 v36.2,48.26 | PICO.P$23 v48.9,48.26 | PICO.P$3 v10.79,34.29 | PICO.P$8 v23.5,34.29 | PICO.P$13 v36.2,34.29 | PICO.P$18 v48.9,34.29 | PICO.38 PICO.P$38 10.79,48.9 v12.06,47.62
  Top 0.381: J2.GND 28.25,19.68 C3.2
  pour Route2: 2.54,15.24 15.24,2.54 143.51,2.54 147.32,6.35 147.32,17.78 179.07,49.53 179.07,116.84 173.99,121.92 13.97,121.92 2.54,110.49
GPIO_0
  Top 0.203: PICO.P$1 PICO.1
GPIO_1
  Top 0.203: PICO.P$2 PICO.2
GPIO_2
  Top 0.203: PICO.P$4 PICO.4
GPIO_3
  Top 0.203: PICO.P$5 PICO.5
GPIO_4
  Top 0.203: PICO.P$6 PICO.6
GPIO_5
  Top 0.203: PICO.P$7 PICO.7
GPIO_6
  Top 0.203: PICO.P$9 PICO.9
GPIO_7
  Top 0.203: PICO.P$10 PICO.10
GPIO_9
  Top 0.203: PICO.P$11 PICO.11
GPIO_13
  Top 0.203: PICO.P$17 PICO.17
GPIO_16  (via drill 0.35)
  Top 0.203: v114.3,73.66 116.84,76.2 CHORD_MAJ.MX2 CHORD_MAJ7.MX2 CHORD_MAJ9.MX2 | PICO.P$21 PICO.21
  Bottom 0.203: KEY_A.MX2 KEY_B.MX2 133.99,97.79 136.59,95.19 136.59,84.52 132.08,80.01 CHORD_MAJ.MX2 | PICO.21 53.98,63.25 54.86,64.14 104.78,64.14 v114.3,73.66
GPIO_17  (via drill 0.35)
  Top 0.203: KEY_A#.MX2 122.75,116.64 122.75,87.83 v111.76,76.83 | PICO.P$22 PICO.22
  Bottom 0.203: KEY_C#.MX2 KEY_D#.MX2 KEY_F#.MX2 KEY_G#.MX2 KEY_A#.MX2 | v111.76,76.83 100.33,65.41 53.34,65.41 51.44,63.5 PICO.22
GPIO_18
  Top 0.203: PICO.P$24 PICO.24
  Bottom 0.203: KEY_C.MX2 KEY_D.MX2 KEY_E.MX2 KEY_F.MX2 KEY_G.MX2 94.81,96.96 94.81,91 70.48,66.67 52.07,66.67 46.35,60.96 PICO.24
GPIO_19  (via drill 0.35)
  Top 0.203: v162.56,38.1 CHORD_DOM9.MX2 CHORD_DOM7.MX2 v109.22,38.1 | CHORD_MIN.MX2 CHORD_MIN7.MX2 CHORD_MIN9.MX2 | PICO.P$25 PICO.25
  Bottom 0.203: CHORD_MIN9.MX2 167.2,56.32 167.2,42.74 v162.56,38.1 | PICO.25 43.81,47.37 47.68,43.51 103.81,43.51 v109.22,38.1
GPIO_20  (via drill 0.35)
  Top 0.203: 41.91,49.91 PICO.26 PICO.P$26 | CHORD_DIM.MX2 CHORD_AUG.MX2 | v103.5,5.08 105.41,3.17 v140.34,3.17
  Bottom 0.203: v103.5,5.08 74.3,5.08 66.04,13.34 66.04,22.86 41.27,47.62 PICO.26 | CHORD_AUG.MX2 143.51,19.05 144.78,17.78 144.78,7.62 v140.34,3.17
GPIO_21  (via drill 0.35)
  Top 0.203: v80.01,95.89 83.82,99.69 v87,99.69 | PICO.P$27 PICO.27
  Bottom 0.203: PICO.27 38.73,56.9 52.32,70.48 67.94,70.48 81.92,84.45 D6.C 80.01,93.06 v80.01,95.89 | v87,99.69 101.88,99.69 110.49,108.31 D5.C 110.63,110.35 112.39,108.58 126.36,108.58 156.21,78.74 156.21,70.2 D23.C 157.48,67.67 D25.C
GPIO_22  (via drill 0.35)
  Top 0.203: v60.96,95.89 v60.96,99.06 | v111.12,106.68 v106.05,106.68 | PICO.P$29 PICO.29
  Bottom 0.203: PICO.29 33.66,57.15 62.87,86.36 D4.C 60.96,93.06 v60.96,95.89 | v60.96,99.06 61.59,99.69 83.82,99.69 91.44,107.31 D7.C 95.19,110.21 95.23,110.17 98.68,110.17 102.17,106.68 v106.05,106.68 | v111.12,106.68 126.36,106.68 137.16,95.89 137.16,70.2 D17.C 138.43,67.67 D16.C
GPIO_26  (via drill 0.35)
  Top 0.203: v41.91,95.89 v41.91,99.06 | v104.78,89.53 104.78,91.1 103.82,92.05 103.82,96.2 v98.42,101.6 | v92.71,108.58 77.47,108.58 v76.83,109.22 | PICO.P$31 PICO.31
  Bottom 0.203: PICO.31 28.57,56.52 43.81,71.75 D3.C 41.91,93.06 v41.91,95.89 | v41.91,99.06 43.81,100.97 63.15,100.97 D8.C 72.75,109.86 76.2,109.86 v76.83,109.22 | D15.C 119.38,67.67 D18.C 117.47,70.84 117.47,76.83 v104.78,89.53 | v98.42,101.6 92.71,107.31 v92.71,108.58
GPIO_27  (via drill 0.35)
  Top 0.203: v22.86,95.89 v22.86,99.06 | v36.83,107.95 99.51,107.95 v113.26,94.21 | PICO.P$32 PICO.32
  Bottom 0.203: PICO.32 26.04,56.9 24.77,58.17 D2.C 22.86,93.06 v22.86,95.89 | v22.86,99.06 24.77,100.97 30.48,100.97 34.29,104.78 D9.C 36.55,107.95 v36.83,107.95 | v113.26,94.21 113.26,91.21 114.94,89.53 118.39,89.53 119.84,90.98 | 119.84,90.98 D19.C | D20.C 130.81,40.28 D14.C 134.62,68.88 133.03,70.46 133.03,72.07 126.36,78.74 126.36,84.45 119.84,90.98
GPIO_28  (via drill 0.35)
  Top 0.203: v15.24,106.68 88.27,106.68 v97.16,97.79 | 20.95,52.07 PICO.P$34 PICO.34
  Bottom 0.203: PICO.34 20.95,56.52 5.71,71.75 D1.C 3.17,93.7 3.17,98.14 D10.C v15.24,106.68 | v97.16,97.79 97.16,94.97 D11.C 100.79,90.98 115.57,76.2 D12.C 111.12,39.65 D13.C
MIDI_TX  (via drill 0.35)
  Top 0.203: v174.62,96.52 173.23,97.92 R23.2 | v74.12,27.48 65.41,36.2 46.35,36.2 43.81,33.66 PICO.16 PICO.P$16 | v140.34,26.04 v109.22,26.04
  Bottom 0.203: v140.34,26.04 152.4,26.04 176.53,50.16 176.53,94.61 v174.62,96.52 | v74.12,27.48 98.25,27.48 99.69,26.04 v109.22,26.04
MPR121_SCL
  Top 0.203: MPR121.SCL 55.88,26.04 53.98,27.94 PICO.20 PICO.P$20
MPR121_SDA
  Top 0.203: MPR121.SDA 55.24,23.5 51.44,27.3 PICO.P$19 51.44,31.11 PICO.19
N$2  (via drill 0.35)
  Top 0.203: IC4.9 63.5,60.96 64.14,60.33 64.14,53.34 67.94,49.53 v73.03,49.53 | v78.11,54.61 IC5.14
  Bottom 0.203: v78.11,54.61 v73.03,49.53
N$3  (via drill 0.35)
  Top 0.203: IC5.9 82.55,60.96 83.19,60.33 83.19,52.7 86.36,49.53 v91.44,49.53 | v96.52,54.61 IC6.14
  Bottom 0.203: v96.52,54.61 v91.44,49.53
N$4
  Top 0.203: 14.08,83.3 LED1.A
  Top 0.381: R1.2 13.88,83.5 14.08,83.3
N$5
  Top 0.381: R2.2 22.77,103.19 LED2.A
N$6
  Top 0.381: R3.2 32.92,83.5 LED3.A
N$7
  Top 0.381: R4.2 41.81,103.19 LED4.A
N$8
  Top 0.381: R5.2 51.98,83.5 LED5.A
N$9
  Top 0.203: 71.23,83.3 LED6.A
  Top 0.381: R6.2 71.03,83.5 71.23,83.3
N$10
  Top 0.381: R7.2 79.92,103.19 LED7.A
N$11
  Top 0.381: LED8.A 90.08,83.5 R8.2
N$12
  Top 0.381: R9.2 98.97,103.19 LED9.A
N$13
  Top 0.381: R10.2 109.12,83.5 LED10.A
N$14
  Top 0.381: R11.2 118.02,103.19 LED11.A
N$15
  Top 0.381: R12.2 128.18,83.5 LED12.A
N$16
  Top 0.203: R14.2 LED_16.A
N$17
  Top 0.203: R13.2 LED_13.A
N$18
  Top 0.203: R16.2 LED_15.A
N$19
  Top 0.203: R15.2 LED_14.A
N$20
  Top 0.203: R17.2 LED_21.A
N$21
  Top 0.203: R18.2 LED_22.A
N$22
  Top 0.203: R19.2 LED_19.A
N$23
  Top 0.203: LED_20.A R20.2
N$24
  Top 0.203: R21.2 LED_17.A
N$25
  Top 0.203: R22.2 LED_18.A
N$26
  Top 0.203: IC4.15 58.42,53.34 54.61,57.15 31.11,57.15 8.89,79.38 R1.1
N$27
  Top 0.203: IC4.1 66.04,52.07 64.77,53.34 64.77,60.96 63.5,62.23 30.48,62.23 22.23,70.48 22.23,98.11 R2.1
N$28
  Top 0.203: R3.1 26.67,80.33 26.67,70.17 33.98,62.87 64.77,62.87 65.41,62.23 65.41,53.98 66.04,53.34 IC4.2
N$29
  Top 0.203: IC4.3 66.67,54.61 66.04,55.24 66.04,62.87 65.41,63.5 48.26,63.5 41.27,70.48 41.27,98.75 R4.1
N$30
  Top 0.203: IC4.4 67.31,55.88 66.67,56.52 66.67,63.5 66.04,64.14 53.34,64.14 46.99,70.48 R5.1
N$31
  Top 0.203: IC4.5 70.48,57.15 73.03,59.69 73.03,62.87 66.04,69.85 R6.1
N$32
  Top 0.203: IC4.6 70.48,58.42 72.39,60.33 72.39,62.23 64.77,69.85 64.77,78.11 64.14,78.74 64.14,95.89 69.53,101.28 R7.1
N$33  (via drill 0.35)
  Top 0.203: R8.1 85.09,74.3 74.3,63.5 v74.3,59.69 | v70.48,59.69 IC4.7
  Bottom 0.203: v74.3,59.69 v70.48,59.69
N$34
  Top 0.203: IC5.15 76.83,53.34 74.93,55.24 74.93,58.42 98.42,81.92 98.42,98.75 R9.1
N$35
  Top 0.203: IC5.1 84.45,52.07 83.82,52.7 83.82,62.87 102.56,81.6 R10.1
N$36
  Top 0.203: IC5.2 85.09,53.34 84.45,53.98 84.45,62.87 100.97,79.38 111.12,79.38 117.47,85.72 117.47,98.75 R11.1
N$37
  Top 0.203: IC5.3 85.72,54.61 85.09,55.24 85.09,62.87 97.16,74.93 111.76,74.93 118.43,81.6 R12.1
N$38
  Top 0.203: R13.1 119.7,64.14 97.79,64.14 90.81,57.15 IC5.5
N$39  (via drill 0.35)
  Top 0.203: v117.16,60.01 113.67,63.5 99.06,63.5 91.44,55.88 IC5.4 | R14.1 118.43,44.77 v118.11,45.09
  Bottom 0.203: v118.11,45.09 118.11,59.05 v117.16,60.01
N$40
  Top 0.203: IC5.6 88.9,58.42 95.25,64.77 139.38,64.77 R15.1
N$41
  Top 0.203: IC5.7 88.9,59.69 94.61,65.41 156.53,65.41 R16.1
N$42
  Top 0.203: R17.1 108.91,6.35 87.63,6.35 83.82,10.16 83.82,36.83 93.34,46.35 93.34,50.16 96.52,53.34 IC6.15
N$43
  Top 0.203: R18.1 127.32,6.99 88.9,6.99 84.45,11.43 84.45,36.83 92.71,45.09 99.06,45.09 105.31,51.33 IC6.1
N$44  (via drill 0.35)
  Top 0.203: IC6.2 106.68,53.34 113.03,46.99 v113.03,39.37 | v113.03,24.77 113.35,24.77 R19.1
  Bottom 0.203: v113.03,39.37 v113.03,24.77
N$45  (via drill 0.35)
  Top 0.203: IC6.3 111.76,54.61 121.28,45.09 130.81,45.09 132.72,43.18 v132.72,39.37 | v133.35,25.4 133.67,25.08 R20.1
  Bottom 0.203: v132.72,39.37 133.35,38.73 v133.35,25.4
N$46
  Top 0.203: IC6.4 112.39,55.88 120.02,48.26 132.08,48.26 137.48,42.86 R21.1
N$47
  Top 0.203: R22.1 150.18,48.9 120.65,48.9 112.39,57.15 IC6.5
N$48
  Top 0.203: R23.1 173.23,107.19 X1.5
N$49
  Top 0.203: R24.2 162.94,101.53 X1.4
N$50
  Bottom 0.203: D23.A 160.38,73.66 CHORD_MAJ9.MX1
N$51
  Bottom 0.203: CHORD_MIN9.MX1 157.48,57.15 D25.A
N$53
  Bottom 0.203: D1.A 6.71,95.25 KEY_C.MX1
N$54
  Bottom 0.203: D10.A 16.23,114.3 KEY_C#.MX1
N$55
  Bottom 0.203: D11.A 101.95,95.25 KEY_A.MX1
N$56
  Bottom 0.203: CHORD_DOM7.MX1 115.57,38.1 D12.A
N$57
  Bottom 0.203: CHORD_DIM.MX1 111.12,19.68 D13.A
N$58
  Bottom 0.203: D2.A 25.75,95.25 KEY_D.MX1
N$59
  Bottom 0.203: D3.A 44.8,95.25 KEY_E.MX1
N$60
  Bottom 0.203: D4.A 63.85,95.25 KEY_F.MX1
N$61
  Bottom 0.203: D6.A 82.91,95.25 KEY_G.MX1
N$62
  Bottom 0.203: D5.A 111.48,114.3 KEY_A#.MX1
N$63
  Bottom 0.203: D7.A 92.43,114.3 KEY_G#.MX1
N$64
  Bottom 0.203: D8.A 73.38,114.3 KEY_F#.MX1
N$65
  Bottom 0.203: D9.A 35.28,114.3 KEY_D#.MX1
N$66
  Bottom 0.203: D19.A 121,95.25 KEY_B.MX1
N$67
  Bottom 0.203: D18.A 122.28,73.66 CHORD_MAJ.MX1
N$68
  Bottom 0.203: D17.A 141.32,73.66 CHORD_MAJ7.MX1
N$69
  Bottom 0.203: CHORD_MIN7.MX1 138.43,57.15 D16.A
N$72
  Bottom 0.203: CHORD_MIN.MX1 119.38,57.15 D15.A
N$73
  Bottom 0.203: CHORD_DOM9.MX1 134.62,38.1 D14.A
N$74
  Bottom 0.203: CHORD_AUG.MX1 130.81,19.05 D20.A
PE
  Top 0.203: X1.PE@ X1.PE
RUN
  Top 0.203: PICO.P$30 PICO.30
SR_CLOCK  (via drill 0.35)
  Top 0.203: v48.89,44.46 41.27,36.84 36.51,36.84 33.81,34.13 33.81,32.29 PICO.12 PICO.P$12 | v57.78,58.42 IC4.11 | v78.11,58.42 IC5.11 | v96.52,58.42 IC6.11
  Bottom 0.203: v48.89,44.46 52.05,47.62 53.98,47.62 57.78,51.44 v57.78,58.42 v78.11,58.42 v96.52,58.42
SR_DATA  (via drill 0.35)
  Top 0.203: v60.33,54.61 IC4.14 | PICO.15 PICO.P$15 41.27,34.29 v51.44,44.45
  Bottom 0.203: v51.44,44.45 57.78,44.45 60.33,46.99 v60.33,54.61
SR_LATCH  (via drill 0.35)
  Top 0.203: v50.16,44.45 38.73,33.02 PICO.14 PICO.P$14 | v59.05,57.15 IC4.12 | v78.11,57.15 IC5.12 | v96.52,57.15 IC6.12
  Bottom 0.203: v50.16,44.45 51.44,45.72 53.98,45.72 59.05,50.8 v59.05,57.15 v78.11,57.15 v96.52,57.15
VBUS
  Top 0.203: PICO.P$40 PICO.40
VSYS
  Top 0.203: PICO.P$39 PICO.39
  Bottom 0.381: D24.C 13.34,44.83 PICO.39